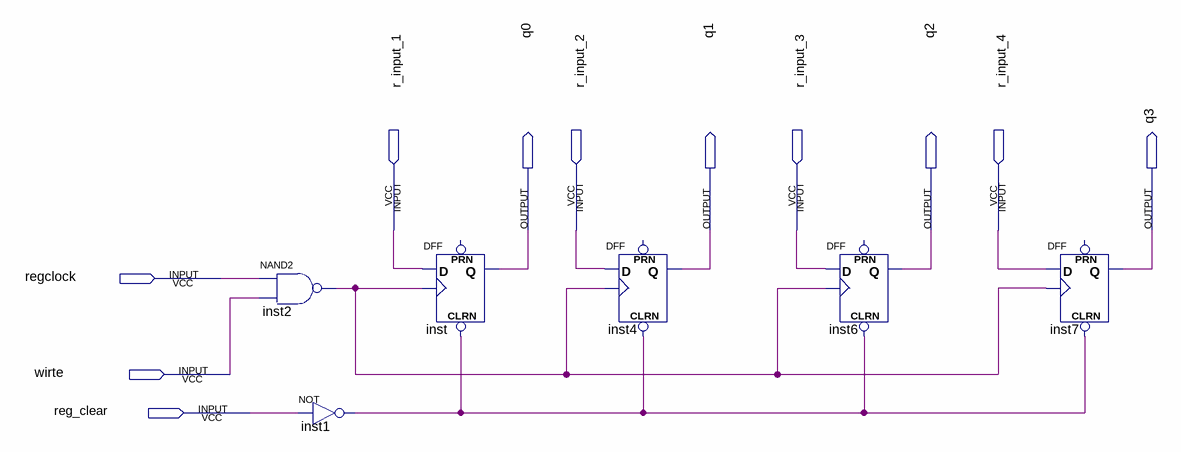
[diagram p0: schematic sheet]
// Quartus schematic reg_paralelo.bdf as structural Verilog: 6 symbols, 11 pins
module reg_paralelo (
  input  r_input_1,
  input  r_input_2,
  input  r_input_3,
  input  r_input_4,
  input  regclock,
  input  wirte,
  input  reg_clear,
  output q0,
  output q1,
  output q2,
  output q3
);

  wire inst1_out, inst2_out;

  nand inst2 (inst2_out, regclock, wirte);
  not inst1 (inst1_out, reg_clear);
  DFF inst (.CLRN(inst1_out), .CLK(inst2_out), .D(r_input_1), .Q(q0));  // open: PRN
  DFF inst4 (.CLRN(inst1_out), .CLK(inst2_out), .D(r_input_2), .Q(q1));  // open: PRN
  DFF inst6 (.CLRN(inst1_out), .CLK(inst2_out), .D(r_input_3), .Q(q2));  // open: PRN
  DFF inst7 (.CLRN(inst1_out), .CLK(inst2_out), .D(r_input_4), .Q(q3));  // open: PRN
endmodule
